# Altium schematic sheet Upload.SchDoc
size A4
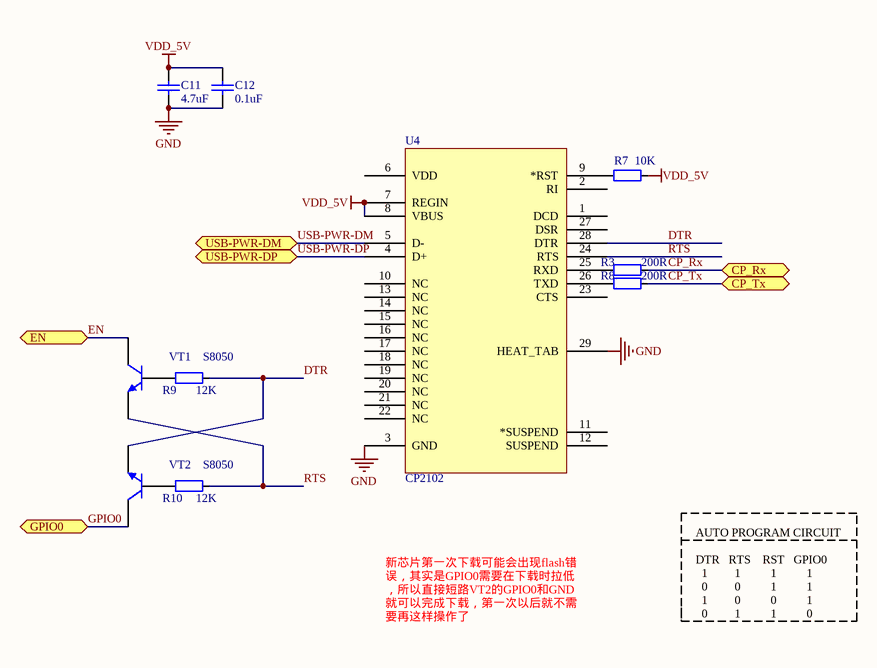
[diagram p0: Upload.SchDoc]

## Parts
C11  4.7uF  [C0603]
C12  0.1uF  [C0603]
R3  200R  [R0603]
R7  10K  [R0603]
R8  200R  [R0603]
R9  12K  [R0603]
R10  12K  [R0603]
U4  CP2102  [QFN-28]
VT1  S8050  [SMT_TRIODE_NPN]
VT2  S8050  [SMT_TRIODE_NPN]

## Ports
CP_Rx, CP_Tx, EN, GPIO0, USB-PWR-DM, USB-PWR-DP

## Nets
GND: C11.2 C12.2 U4.3(GND) U4.29(HEAT_TAB)
VDD_5V: C11.1 C12.1 R7.1 U4.7(REGIN) U4.8(VBUS)
CP_Rx: R3.1 ; port CP_Rx
CP_Tx: R8.1 ; port CP_Tx
DTR: R9.1 U4.28(DTR) VT2.2(E)
EN: VT1.3(C) ; port EN
GPIO0: VT2.3(C) ; port GPIO0
RTS: R10.1 U4.24(RTS) VT1.2(E)
USB-PWR-DM: U4.5(D-) ; port USB-PWR-DM
USB-PWR-DP: U4.4(D+) ; port USB-PWR-DP
NetR3_2: R3.2 U4.25(RXD)
NetR7_2: R7.2 U4.9(*RST)
NetR8_2: R8.2 U4.26(TXD)
NetR9_2: R9.2 VT1.1(B)
NetR10_2: R10.2 VT2.1(B)

Not connected (* = marked no-connect by the designer): U4 1(DCD) 2(RI) 6(VDD) 10(NC) 11(*SUSPEND) 12(SUSPEND) 13(NC) 14(NC) 15(NC) 16(NC) 17(NC) 18(NC) 19(NC) 20(NC) 21(NC) 22(NC) 23(CTS) 27(DSR)

## Notes on the sheet
- AUTO PROGRAM CIRCUIT
  DTR   RTS    RST   GPIO0
  1         1          1          1
  0         0          1          1
  1         0          0          1
  0         1          1          0
- 新芯片第一次下载可能会出现flash错误，其实是GPIO0需要在下载时拉低，所以直接短路VT2的GPIO0和GND就可以完成下载，第一次以后就不需要再这样操作了

## Library data of the parts
C11 C12 = Cap: Capacitor; Value: 1.0uF/50V; Published: 8-Jun-2000; LatestRevisionDate: 17-Jul-2002; LatestRevisionNote: Re-released for DXP Platform.; PackageReference: RAD-0.3; Publisher: Altium Limited; PackageDescription: Radial Cap, Thru-Hole; 2 Leads; 0.3 in Pin Spacing
R3 R7-R10 = 电阻-0402: Resistor; Value: 22R
U4 = CP2102: USB转TTL; PART DESC: SINGLE-CHIP USB TO UART BRIDGE, QFN28, RoHS.; MFG #1: SILICON LABS; PART NUMBER: CP2102; Value: Value; RefDes: RefDes; Type: DEV
VT1 VT2 = SMT_TRIODE_NPN: Surface mount NPN transistor, package SOT-23